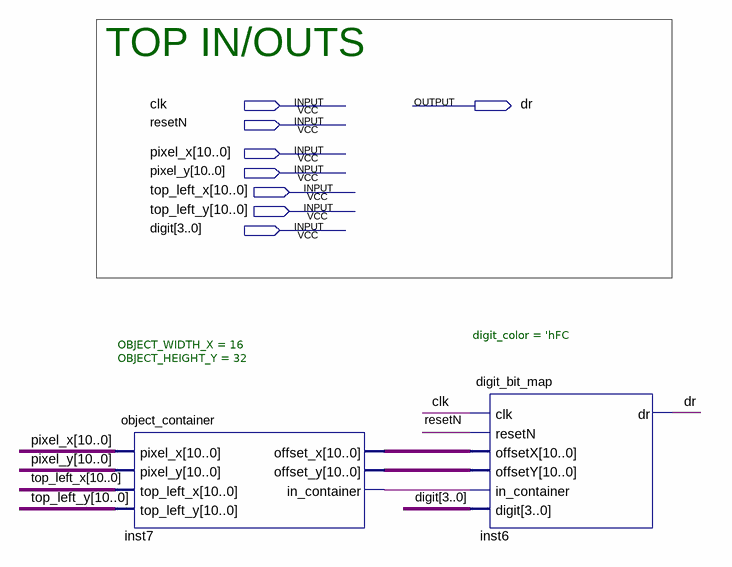
[diagram p0: schematic sheet]
// Quartus schematic TOP_DIGIT.bdf as structural Verilog: 2 symbols, 8 pins
module TOP_DIGIT (
  input  clk,
  input  resetN,
  input  [10:0] pixel_x,
  input  [10:0] pixel_y,
  input  [10:0] top_left_x,
  input  [10:0] top_left_y,
  input  [3:0] digit,
  output dr
);

  wire inst7_in_container;
  wire [10:0] inst7_offset_x, inst7_offset_y;

  object_container #(.OBJECT_WIDTH_X(16), .OBJECT_HEIGHT_Y(32)) inst7 (
    .pixel_x(pixel_x), .pixel_y(pixel_y), .top_left_x(top_left_x), .top_left_y(top_left_y),
    .offset_x(inst7_offset_x), .offset_y(inst7_offset_y), .in_container(inst7_in_container));
  digit_bit_map #(.digit_color('hFC)) inst6 (
    .clk(clk), .resetN(resetN), .offsetX(inst7_offset_x), .offsetY(inst7_offset_y),
    .in_container(inst7_in_container), .digit(digit), .dr(dr));

  // Notes on the sheet:
  //   TOP IN/OUTS
endmodule
